# Altium schematic sheet BPC_Clock.SchDoc
size A4
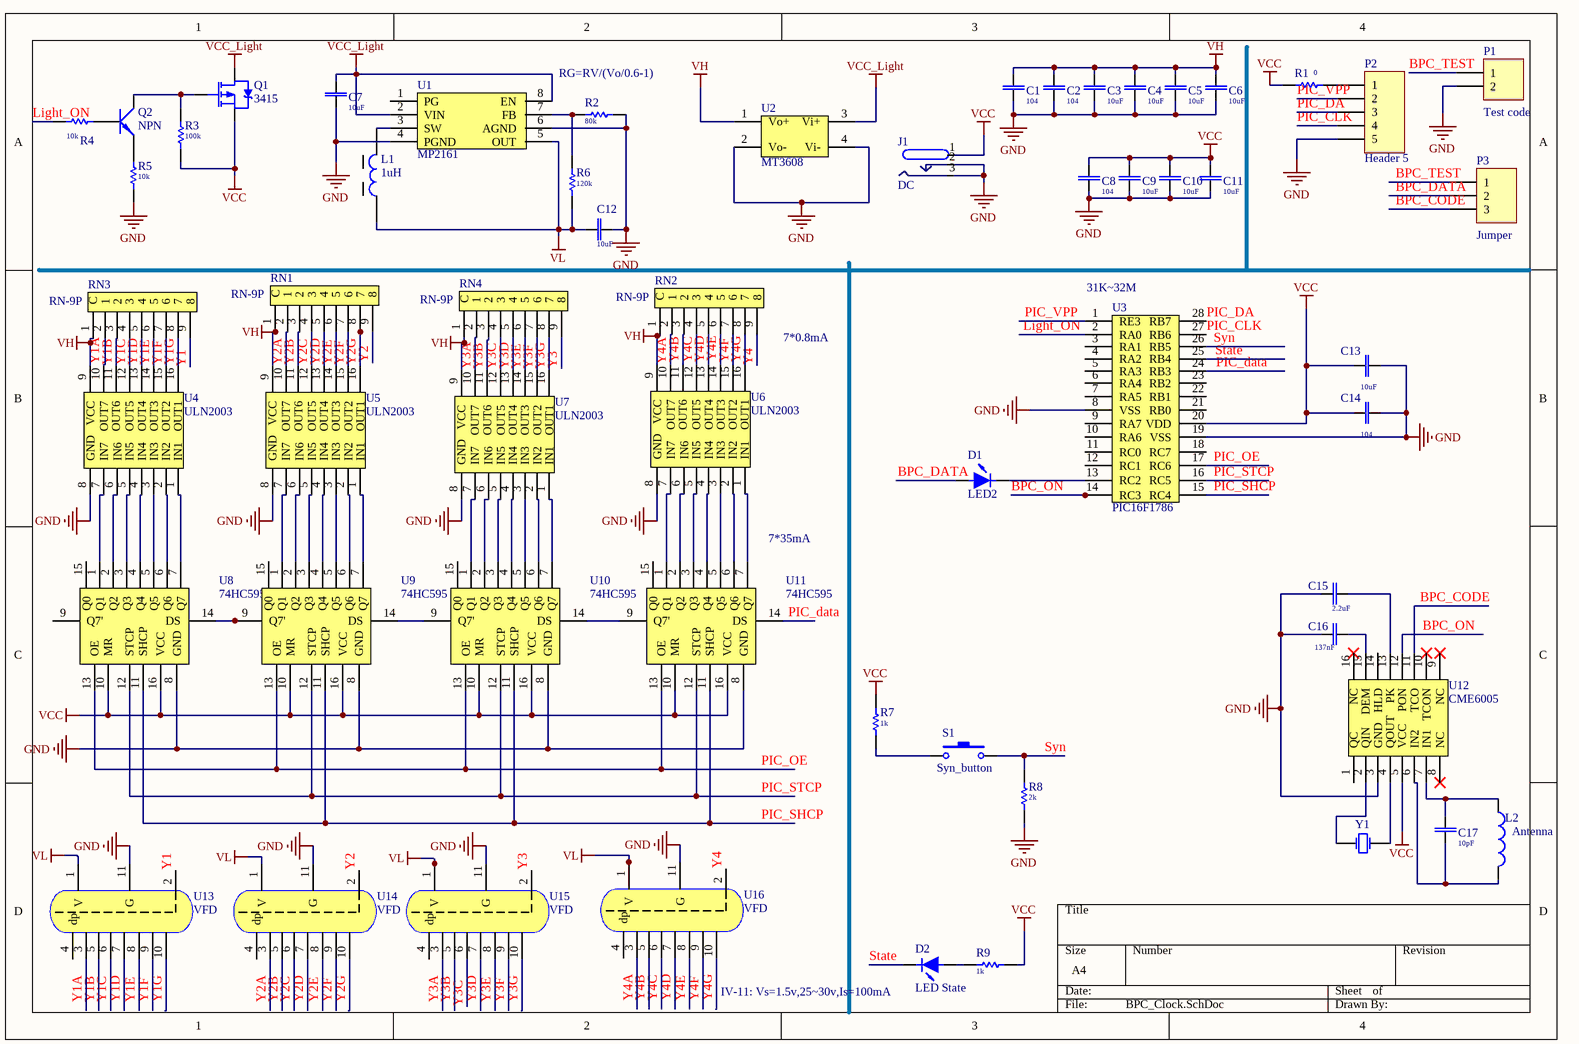
[diagram p0: BPC_Clock.SchDoc]

## Parts
C1  value 104  [CAPC2012N]  (hidden comment: Cap)
C2  value 104  [CAPC2012N]  (hidden comment: Cap)
C3  value 10uF  [CAPC2012N]  (hidden comment: Cap)
C4  value 10uF  [CAPC2012N]  (hidden comment: Cap)
C5  value 10uF  [CAPC2012N]  (hidden comment: Cap)
C6  value 10uF  [CAPC2012N]  (hidden comment: Cap)
C7  value 10uF  [CAPC2012N]  (hidden comment: Cap)
C8  value 104  [CAPC2012N]  (hidden comment: Cap)
C9  value 10uF  [CAPC2012N]  (hidden comment: Cap)
C10  value 10uF  [CAPC2012N]  (hidden comment: Cap)
C11  value 10uF  [CAPC2012N]  (hidden comment: Cap)
C12  value 10uF  [CAPC2012N]  (hidden comment: Cap)
C13  value 10uF  [CAPC2012N]  (hidden comment: Cap)
C14  value 104  [CAPC2012N]  (hidden comment: Cap)
C15  value 2.2uF  [CAPC2012N]  (hidden comment: Cap)
C16  value 137nF  [CAPC2012N]  (hidden comment: Cap)
C17  value 10pF  [CAPC2012N]  (hidden comment: Cap)
D1  LED2  [DSO-F2/D6.1]
D2  LED State  [DSO-F2/D6.1]
J1  DC  [DC]
L1  Chip inductors  [CAPC1608N]  (value not drawn)
L2  Antenna  [CAPC2012N]
P1  Test code  [HDR1X2]
P2  Header 5  [HDR1X5]
P3  Jumper  [HDR1X3]
Q1  3415  [LC-SOT-23(SOT-23-3)]
Q2  NPN  [BCY-W3]
R1  0  [RES 0805N (2012)]
R2  80k  [RES 0805N (2012)]
R3  100k  [RES 0805N (2012)]
R4  10k  [RES 0805N (2012)]
R5  10k  [RES 0805N (2012)]
R6  120k  [RES 0805N (2012)]
R7  1k  [RES 0805N (2012)]
R8  2k  [RES 0805N (2012)]
R9  1k  [RES 0805N (2012)]
RN1  RN-9P  [RN-9P]
RN2  RN-9P  [RN-9P]
RN3  RN-9P  [RN-9P]
RN4  RN-9P  [RN-9P]
S1  Syn_button  [sw]
U1  MP2161  [LC-TSOT-23-8]
U2  MT3608  [MT3608]
U3  PIC16F1786  [PIC-28]
U4  ULN2003  [LC-SOP-16_150mil]
U5  ULN2003  [LC-SOP-16_150mil]
U6  ULN2003  [LC-SOP-16_150mil]
U7  ULN2003  [LC-SOP-16_150mil]
U8  74HC595  [LC-DIP-16]
U9  74HC595  [LC-DIP-16]
U10  74HC595  [LC-DIP-16]
U11  74HC595  [LC-DIP-16]
U12  CME6005  [CME6005]
U13  VFD  [IV-11]
U14  VFD  [IV-11]
U15  VFD  [IV-11]
U16  VFD  [IV-11]
Y1  XTAL  [BCY-W2/D3.1]  (value not drawn)

## Nets
GND: C1.2 C2.2 C3.2 C4.2 C5.2 C6.2 C7.2 C8.2 C9.2 C10.2 C11.2 C12.2 C13.2 C14.2 C15.2 C16.2 J1.2 J1.3 P1.2 P2.5 R2.1 R5.1 R8.1 U1.4(PGND) U1.6(AGND) U2.2(Vo-) U2.4(Vi-) U3.8(VSS) U3.19(VSS) U4.8(GND) U5.8(GND) U6.8(GND) U7.8(GND) U8.8(GND) U9.8(GND) U10.8(GND) U11.8(GND) U12.3(GND) U13.11(G) U14.11(G) U15.11(G) U16.11(G)
VCC: C8.1 C9.1 C10.1 C11.1 C13.1 C14.1 J1.1 Q1.3(S) R1.2 R3.1 R7.2 R9.2 U3.20(VDD) U8.10(MR) U8.16(VCC) U9.10(MR) U9.16(VCC) U10.10(MR) U10.16(VCC) U11.10(MR) U11.16(VCC) U12.5(VCC)
VCC_Light: C7.1 Q1.2(D) U1.2(VIN) U1.8(EN) U2.3(Vi+)
VH: C1.1 C2.1 C3.1 C4.1 C5.1 C6.1 RN1.1(C) RN2.1(C) RN3.1(C) RN4.1(C) U2.1(Vo+) U4.9(VCC) U5.9(VCC) U6.9(VCC) U7.9(VCC)
VL: C12.1 L1.1 R6.2 U1.5(OUT) U13.1(V) U14.1(V) U15.1(V) U16.1(V)
BPC_CODE: P3.3 U12.11(TCO)
BPC_DATA: D1.1(A) P3.2
BPC_ON: U3.14(RC3) U12.12(PON)
BPC_TEST: P1.1 P3.1
Light_ON: R4.1 U3.2(RA0)
PIC_CLK: P2.4 U3.27(RB6)
PIC_DA: P2.3 U3.28(RB7)
PIC_data: U3.24(RB3) U11.14(DS)
PIC_OE: U3.17(RC6) U8.13(OE) U9.13(OE) U10.13(OE) U11.13(OE)
PIC_SHCP: U3.15(RC4) U8.11(SHCP) U9.11(SHCP) U10.11(SHCP) U11.11(SHCP)
PIC_STCP: U3.16(RC5) U8.12(STCP) U9.12(STCP) U10.12(STCP) U11.12(STCP)
PIC_VPP: P2.2 U3.1(RE3)
State: D2.2(K) U3.25(RB4)
Syn: R8.2 S1.2 U3.26(RB5)
Y1: RN3.9(8) U13.2
Y1A: RN3.2(1) U4.10(OUT7) U13.3(c)
Y1B: RN3.3(2) U4.11(OUT6) U13.5(e)
Y1C: RN3.4(3) U4.12(OUT5) U13.6(f)
Y1D: RN3.5(4) U4.13(OUT4) U13.7(g)
Y1E: RN3.6(5) U4.14(OUT3) U13.8(a)
Y1F: RN3.7(6) U4.15(OUT2) U13.9(b)
Y1G: RN3.8(7) U4.16(OUT1) U13.10(c)
Y2: RN1.9(8) U14.2
Y2A: RN1.2(1) U5.10(OUT7) U14.3(c)
Y2B: RN1.3(2) U5.11(OUT6) U14.5(e)
Y2C: RN1.4(3) U5.12(OUT5) U14.6(f)
Y2D: RN1.5(4) U5.13(OUT4) U14.7(g)
Y2E: RN1.6(5) U5.14(OUT3) U14.8(a)
Y2F: RN1.7(6) U5.15(OUT2) U14.9(b)
Y2G: RN1.8(7) U5.16(OUT1) U14.10(c)
Y3: RN4.9(8) U15.2
Y3A: RN4.2(1) U7.10(OUT7) U15.3(c)
Y3B: RN4.3(2) U7.11(OUT6) U15.5(e)
Y3C: RN4.4(3) U7.12(OUT5) U15.6(f)
Y3D: RN4.5(4) U7.13(OUT4) U15.7(g)
Y3E: RN4.6(5) U7.14(OUT3) U15.8(a)
Y3F: RN4.7(6) U7.15(OUT2) U15.9(b)
Y3G: RN4.8(7) U7.16(OUT1) U15.10(c)
Y4: RN2.9(8) U16.2
Y4A: RN2.2(1) U6.10(OUT7) U16.3(c)
Y4B: RN2.3(2) U6.11(OUT6) U16.5(e)
Y4C: RN2.4(3) U6.12(OUT5) U16.6(f)
Y4D: RN2.5(4) U6.13(OUT4) U16.7(g)
Y4E: RN2.6(5) U6.14(OUT3) U16.8(a)
Y4F: RN2.7(6) U6.15(OUT2) U16.9(b)
Y4G: RN2.8(7) U6.16(OUT1) U16.10(c)
NetC15_1: C15.1 U12.13(PK)
NetC16_1: C16.1 U12.15(DEM)
NetC17_1: C17.1 L2.1 U12.7(IN1)
NetC17_2: C17.2 L2.2 U12.6(IN2)
NetD1_2: D1.2(K) U3.13(RC2)
NetD2_1: D2.1(A) R9.1
NetL1_2: L1.2 U1.3(SW)
NetP2_1: P2.1 R1.1
NetQ1_1: Q1.1(G) Q2.1(C) R3.2
NetQ2_2: Q2.2(B) R4.2
NetQ2_3: Q2.3(E) R5.2
NetR2_2: R2.2 R6.1 U1.7(FB)
NetR7_1: R7.1 S1.1
NetU4_1: U4.1(IN1) U8.7(Q7)
NetU4_2: U4.2(IN2) U8.6(Q6)
NetU4_3: U4.3(IN3) U8.5(Q5)
NetU4_4: U4.4(IN4) U8.4(Q4)
NetU4_5: U4.5(IN5) U8.3(Q3)
NetU4_6: U4.6(IN6) U8.2(Q2)
NetU4_7: U4.7(IN7) U8.1(Q1)
NetU5_1: U5.1(IN1) U9.7(Q7)
NetU5_2: U5.2(IN2) U9.6(Q6)
NetU5_3: U5.3(IN3) U9.5(Q5)
NetU5_4: U5.4(IN4) U9.4(Q4)
NetU5_5: U5.5(IN5) U9.3(Q3)
NetU5_6: U5.6(IN6) U9.2(Q2)
NetU5_7: U5.7(IN7) U9.1(Q1)
NetU6_1: U6.1(IN1) U11.7(Q7)
NetU6_2: U6.2(IN2) U11.6(Q6)
NetU6_3: U6.3(IN3) U11.5(Q5)
NetU6_4: U6.4(IN4) U11.4(Q4)
NetU6_5: U6.5(IN5) U11.3(Q3)
NetU6_6: U6.6(IN6) U11.2(Q2)
NetU6_7: U6.7(IN7) U11.1(Q1)
NetU7_1: U7.1(IN1) U10.7(Q7)
NetU7_2: U7.2(IN2) U10.6(Q6)
NetU7_3: U7.3(IN3) U10.5(Q5)
NetU7_4: U7.4(IN4) U10.4(Q4)
NetU7_5: U7.5(IN5) U10.3(Q3)
NetU7_6: U7.6(IN6) U10.2(Q2)
NetU7_7: U7.7(IN7) U10.1(Q1)
NetU8_14: U8.14(DS) U9.9(Q7')
NetU9_14: U9.14(DS) U10.9(Q7')
NetU10_14: U10.14(DS) U11.9(Q7')
NetU12_2: U12.2(QIN) Y1.1(OSC1)
NetU12_4: U12.4(QOUT) Y1.2(OSC2)

Not connected (* = marked no-connect by the designer): U1 1(PG); U3 3(RA1) 4(RA2) 5(RA3) 6(RA4) 7(RA5) 9(RA7) 10(RA6) 11(RC0) 12(RC1) 18(RC7) 21(RB0) 22(RB1) 23(RB2); U8 9(Q7') 15(Q0); U9 15(Q0); U10 15(Q0); U11 15(Q0); U12 1(QC) 8(NC)* 9(NC)* 10(TCON)* 14(HLD) 16(NC)*; U13 4(dp); U14 4(dp); U15 4(dp); U16 4(dp)

## Notes on the sheet
- RG=RV/(Vo/0.6-1)
- (near U3) 31K~32M
- (near RN2) 7*0.8mA
- (near U11) 7*35mA
- (near D2) IV-11: Vs=1.5v,25~30v,Is=100mA
- (in symbol Chip inductors) 1uH

## Library data of the parts
C1-C17 = Cap: Capacitor; Published: 8-Jun-2000; LatestRevisionDate: 17-Jul-2002; LatestRevisionNote: Re-released for DXP Platform.; PackageReference: RAD-0.3; Publisher: Altium Limited
D1 D2 = LED2: Typical RED, GREEN, YELLOW, AMBER GaAs LED; Published: 8-Jun-2000; LatestRevisionDate: 17-Jul-2002; LatestRevisionNote: Re-released for DXP Platform.; PackageVersion: Feb-2002; PackageReference: 3.2X1.6X1.1; Publisher: Altium Limited
L2 = Inductor: Code_IEC: 1005; Value: 10mH; Published: 8-Jun-2000; LatestRevisionDate: 29-May-2009; LatestRevisionNote: IPC-7351 Footprint Added.; PackageReference: 0402-A; Publisher: Altium Limited; PackageDescription: Chip Inductor; Code_JEITA: 0402
P1 = Header 2: Header, 2-Pin; LatestRevisionDate: 17-Jul-2002; LatestRevisionNote: Re-released for DXP Platform.; Publisher: Altium Limited
P2 = Header 5: Header, 5-Pin; LatestRevisionDate: 17-Jul-2002; LatestRevisionNote: Re-released for DXP Platform.; Publisher: Altium Limited
P3 = Header 3: Header, 3-Pin; LatestRevisionDate: 17-Jul-2002; LatestRevisionNote: Re-released for DXP Platform.; Publisher: Altium Limited
Q1 = PMOS-2: P-Channel Power MOSFET; Note: Pin 4 not drawn and electrically connected to Pin 2.; Published: 8-Jun-2000; LatestRevisionDate: 17-Jul-2002; LatestRevisionNote: Re-released for DXP Platform.; DatasheetVersion: PD-9.390D; PackageReference: TO-220AB; Publisher: Altium Limited; Code_JEDEC: TO-220-AB; ComponentLink1Description: Manufacturer Link; ComponentLink1URL: http://www.irf.com/
Q2 = NPN: NPN Bipolar Transistor; Published: 8-Jun-2000; LatestRevisionDate: 17-Jul-2002; LatestRevisionNote: Re-released for DXP Platform.; PackageReference: TO-226; Publisher: Altium Limited; Code_JEDEC: TO-226-AA
R1-R9 = Res1: Resistor; Published: 8-Jun-2000; LatestRevisionDate: 17-Jul-2002; LatestRevisionNote: Re-released for DXP Platform.; PackageReference: AXIAL-0.3; Publisher: Altium Limited
  R1: Value: 0
  R2: Value: 80k
  R3: Value: 100k
  R4 R5: Value: 10k
  R6: Value: 120k
  R7 R9: Value: 1k
  R8: Value: 2k
S1 = SW-PB: Switch; Published: 24-Mar-1999; LatestRevisionDate: 17-Jul-2002; LatestRevisionNote: Re-released for DXP Platform.; PackageReference: SPST-2; Publisher: Altium Limited
Y1 = XTAL: Crystal Oscillator; Published: 8-Jun-2000; LatestRevisionDate: 17-Jul-2002; LatestRevisionNote: Re-released for DXP Platform.; PackageReference: R38; Publisher: Altium Limited